# Altium schematic sheet 07_USB_Type-C_DFP_DP_ALT.SchDoc: USB-C Connectors
size A2; Organization: Greenfield Tech Solutions; Address1: Molendreef 33; Address2: Ossendrecht; Address3: 4641CS; Address4: The Netherlands; SheetNumber: 7; SheetTotal: 11
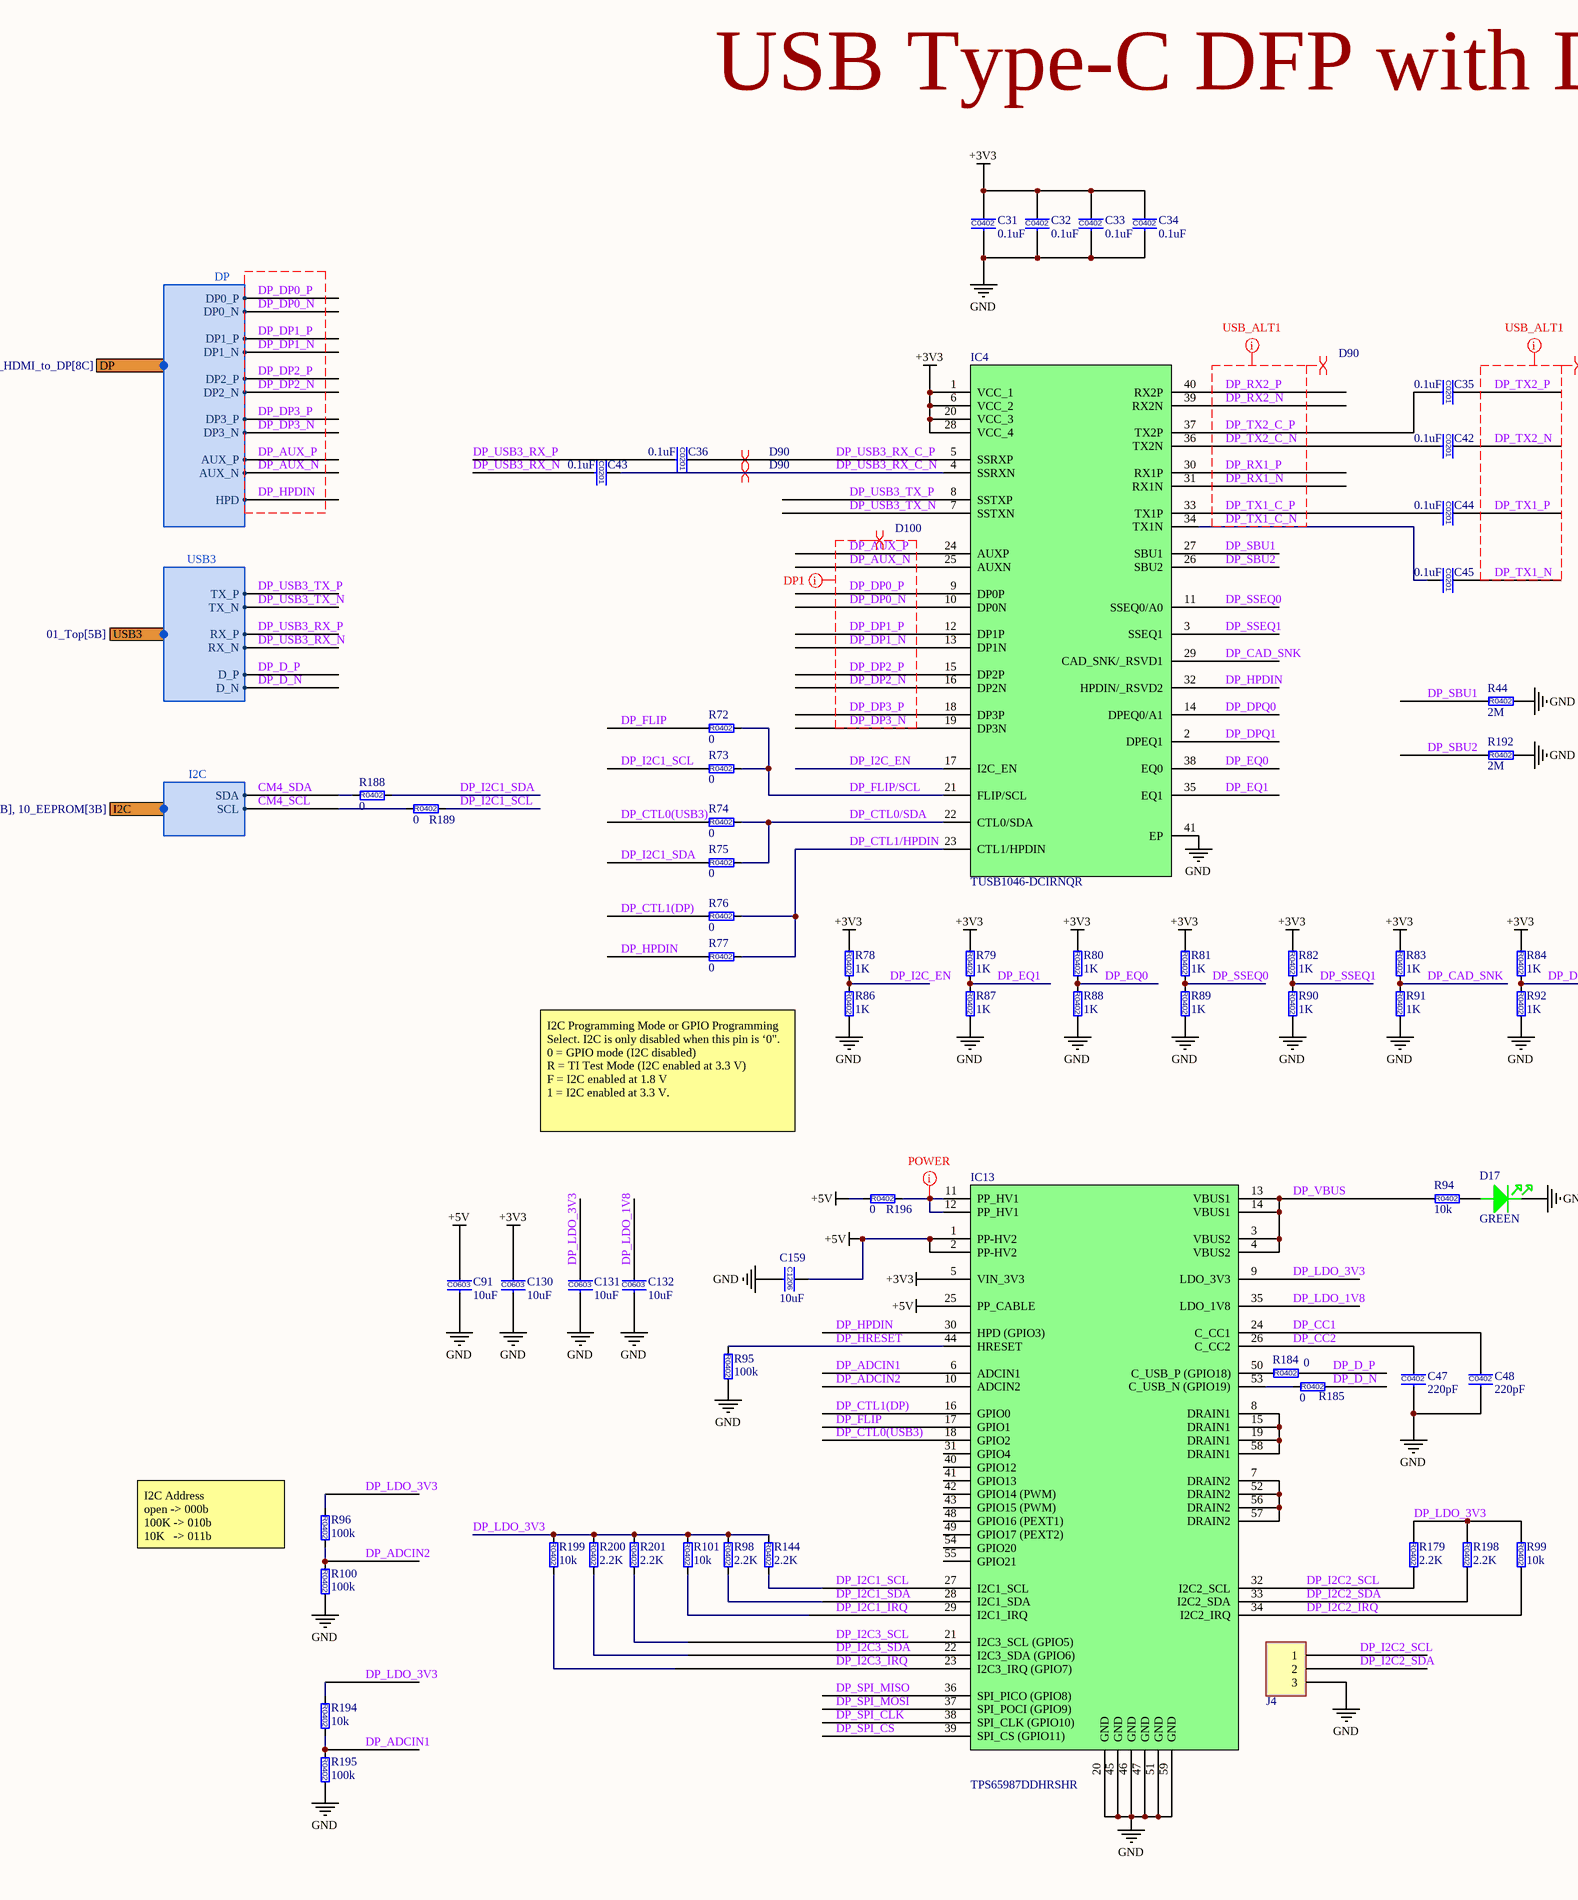
[diagram p0: 07_USB_Type-C_DFP_DP_ALT.SchDoc, left]
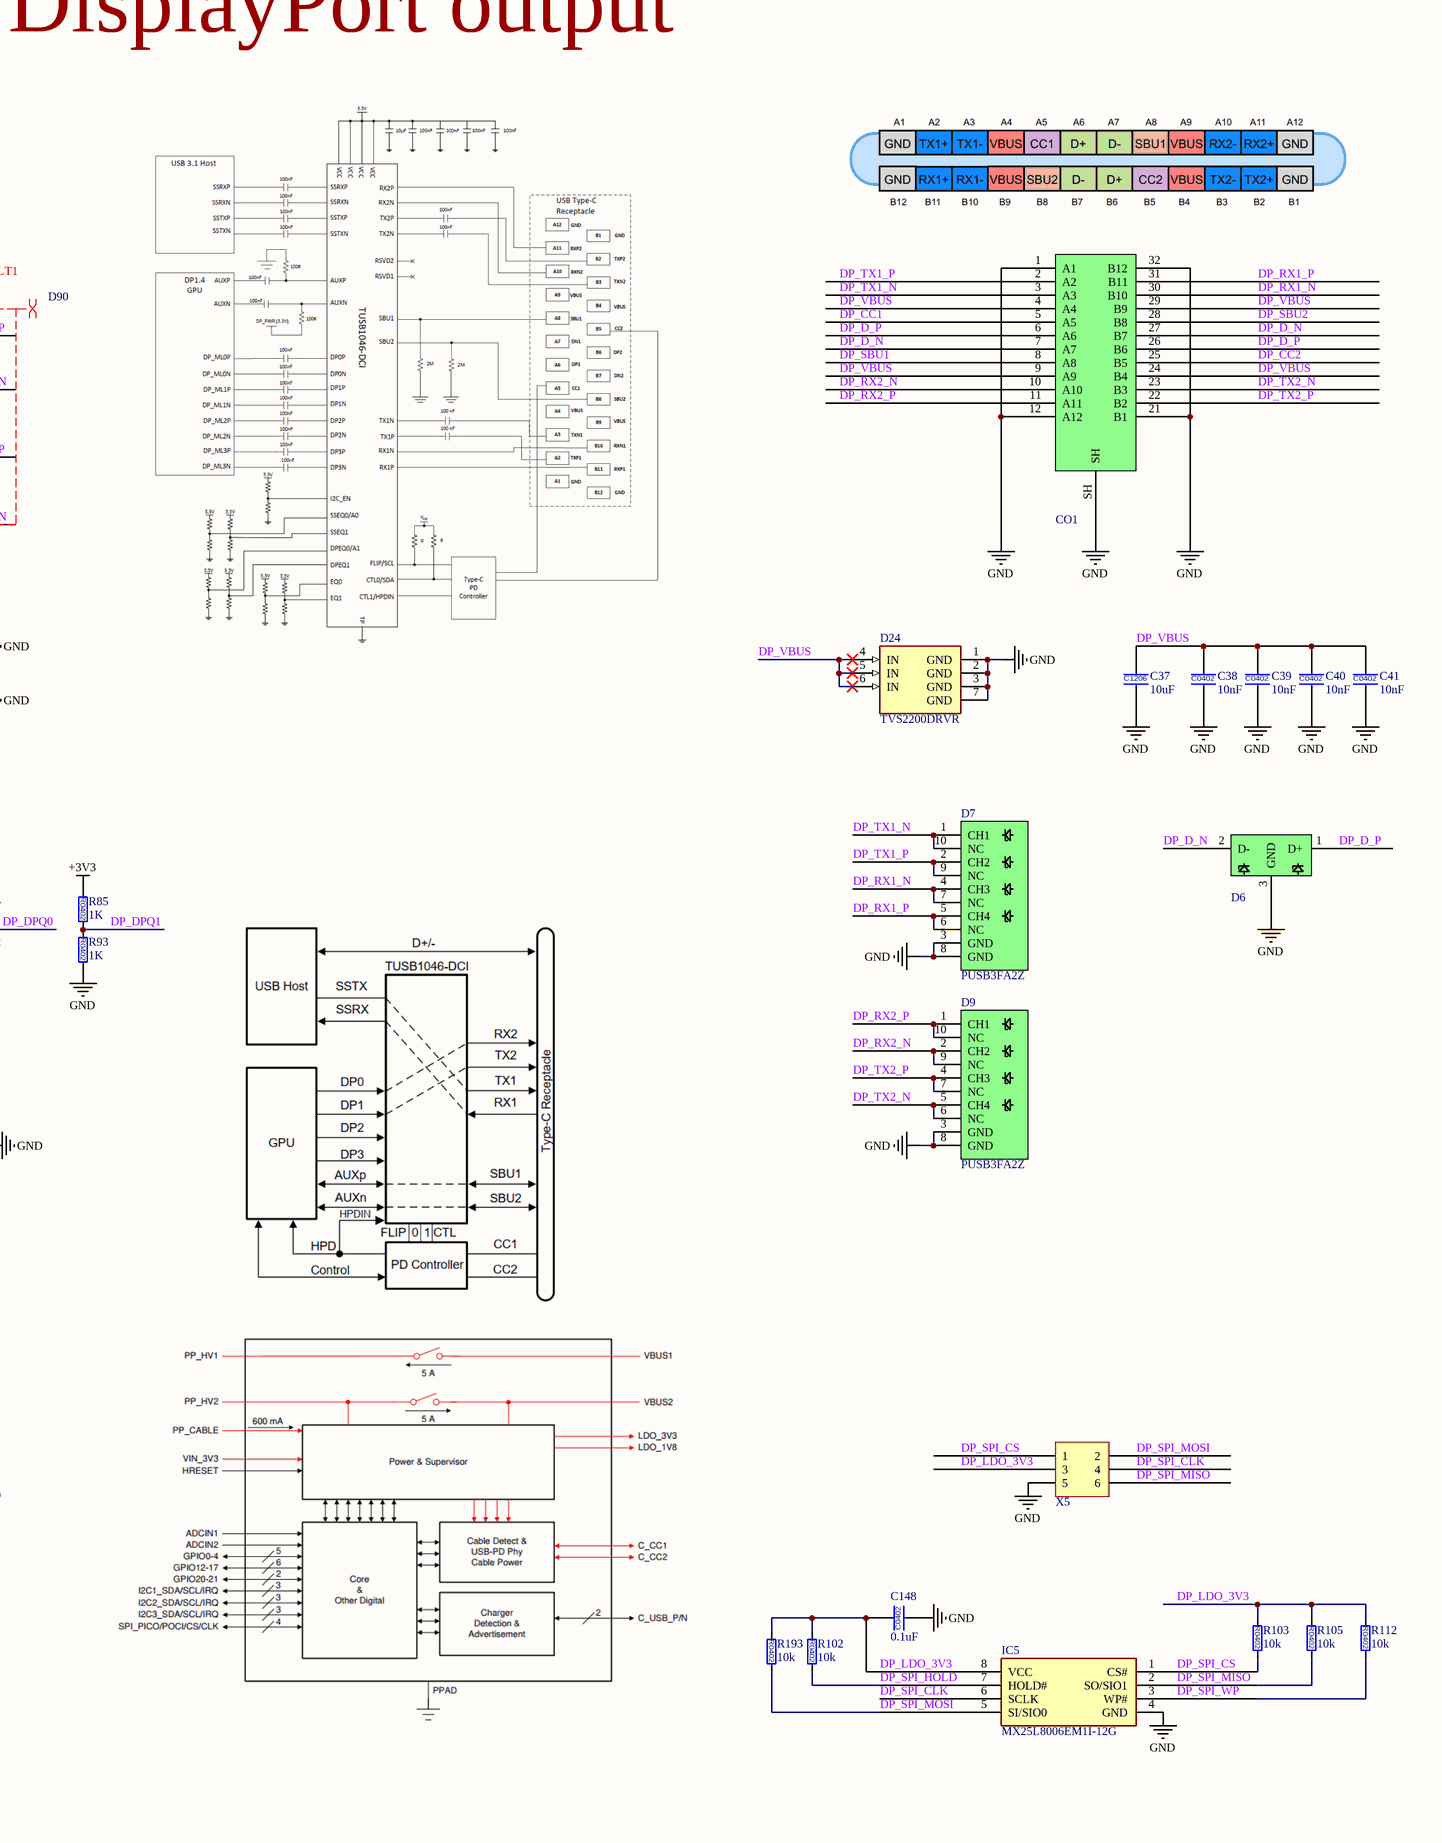
[diagram p1: 07_USB_Type-C_DFP_DP_ALT.SchDoc, right]

## Parts
C31  0.1uF  [C0402]
C32  0.1uF  [C0402]
C33  0.1uF  [C0402]
C34  0.1uF  [C0402]
C35  0.1uF  [C0201]
C36  0.1uF  [C0201]
C37  10uF  [C1206]
C38  10nF  [C0402]
C39  10nF  [C0402]
C40  10nF  [C0402]
C41  10nF  [C0402]
C42  0.1uF  [C0201]
C43  0.1uF  [C0201]
C44  0.1uF  [C0201]
C45  0.1uF  [C0201]
C47  220pF  [C0402]
C48  220pF  [C0402]
C91  10uF  [C0603]
C130  10uF  [C0603]
C131  10uF  [C0603]
C132  10uF  [C0603]
C148  0.1uF  [C0402]
C159  10uF  [C1206]
CO1  USB4070-30-C  [USB4070-30-C]  (value not drawn)
D6  TPD2EUSB30DRTR  [TPD2EUSB30DRTR_SOT-3]  (value not drawn)
D7  PUSB3FA2Z  [PUSB3FA2Z_DFN_2510_10]
D9  PUSB3FA2Z  [PUSB3FA2Z_DFN_2510_10]
D17  GREEN  [LED_0603]
D24  TVS2200DRVR  [TVS2200D_SON_6]
IC4  TUSB1046-DCIRNQR  [TUSB1046_WQFN_40]
IC5  MX25L8006EM1I-12G  [SOIC127P600X175-8N]
IC13  TPS65987DDHRSHR  [TPS65987D_VQFN-56]
J4  PLS-3  [PLS-3-3D]  (value not drawn)
R44  2M  [R0402]
R72  0  [R0402]
R73  0  [R0402]
R74  0  [R0402]
R75  0  [R0402]
R76  0  [R0402]
R77  0  [R0402]
R78  1K  [R0402]
R79  1K  [R0402]
R80  1K  [R0402]
R81  1K  [R0402]
R82  1K  [R0402]
R83  1K  [R0402]
R84  1K  [R0402]
R85  1K  [R0402]
R86  1K  [R0402]
R87  1K  [R0402]
R88  1K  [R0402]
R89  1K  [R0402]
R90  1K  [R0402]
R91  1K  [R0402]
R92  1K  [R0402]
R93  1K  [R0402]
R94  10k  [R0402]
R95  100k  [R0402]
R96  100k  [R0402]
R98  2.2K  [R0402]
R99  10k  [R0402]
R100  100k  [R0402]
R101  10k  [R0402]
R102  10k  [R0402]
R103  10k  [R0402]
R105  10k  [R0402]
R112  10k  [R0402]
R144  2.2K  [R0402]
R179  2.2K  [R0402]
R184  0  [R0402]
R185  0  [R0402]
R188  0  [R0402]
R189  0  [R0402]
R192  2M  [R0402]
R193  10k  [R0402]
R194  10k  [R0402]
R195  100k  [R0402]
R196  0  [R0402]
R198  2.2K  [R0402]
R199  10k  [R0402]
R200  2.2K  [R0402]
R201  2.2K  [R0402]
X5  PBD-6  [PXD-6]  (value not drawn)

## Ports
DP (harness DP, see 01_Top[4B], 05_HDMI_to_DP[8C]), I2C (harness I2C, see 01_Top[4B], 03_RPiCM4[1B], 05_HDMI_to_DP[1B], 06_USB_Type-C_DFP[1B], 08_USB_Type-C_DFP_DP_ALT_buttom[1B], 09_RTC[3B], 10_EEPROM[3B]), USB3 (harness USB3, see 01_Top[5B])

## Harnesses
USB3: TX_P, TX_N, RX_P, RX_N, D_P, D_N
I2C: SDA, SCL
DP: DP0_P, DP1_P, DP1_N, DP0_N, DP3_P, DP3_N, DP2_P, DP2_N, AUX_P, AUX_N, HPD

## Nets
+3V3: C31.1 C32.1 C33.1 C34.1 C130.1 IC4.1(VCC_1) IC4.6(VCC_2) IC4.20(VCC_3) IC4.28(VCC_4) IC13.5(VIN_3V3) R78.1 R79.1 R80.1 R81.1 R82.1 R83.1 R84.1 R85.1
+5V: C91.1 C159.1 IC13.1(PP-HV2) IC13.2(PP-HV2) IC13.25(PP_CABLE) R196.1
GND: C31.2 C32.2 C33.2 C34.2 C37.2 C38.2 C39.2 C40.2 C41.2 C47.2 C48.2 C91.2 C130.2 C131.2 C132.2 C148.2 C159.2 CO1.1(A1) CO1.12(A12) CO1.21(B1) CO1.32(B12) CO1.SH D6.3(GND) D7.3(GND) D7.8(GND) D9.3(GND) D9.8(GND) D17.1(Cathode) D24.1(GND) D24.2(GND) D24.3(GND) D24.7(GND) IC4.41(EP) IC5.4(GND) IC13.20(GND) IC13.45(GND) IC13.46(GND) IC13.47(GND) IC13.51(GND) IC13.59(GND) J4.3 R44.2 R86.2 R87.2 R88.2 R89.2 R90.2 R91.2 R92.2 R93.2 R95.2 R100.2 R192.2 R195.2 X5.5
CM4_SCL: R189.1 ; port I2C.SCL
CM4_SDA: R188.1 ; port I2C.SDA
DP_ADCIN1: IC13.6(ADCIN1) R194.2 R195.1
DP_ADCIN2: IC13.10(ADCIN2) R96.2 R100.1
DP_AUX_N: IC4.25(AUXN) ; port DP.AUX_N
DP_AUX_P: IC4.24(AUXP) ; port DP.AUX_P
DP_CAD_SNK: IC4.29(CAD_SNK/_RSVD1) R83.2 R91.1
DP_CC1: C48.1 CO1.5(A5) IC13.24(C_CC1)
DP_CC2: C47.1 CO1.25(B5) IC13.26(C_CC2)
DP_CTL0(USB3): IC13.18(GPIO2) R74.1
DP_CTL0/SDA: IC4.22(CTL0/SDA) R74.2 R75.2
DP_CTL1(DP): IC13.16(GPIO0) R76.1
DP_CTL1/HPDIN: IC4.23(CTL1/HPDIN) R76.2 R77.2
DP_D_N: CO1.7(A7) CO1.27(B7) D6.2(D-) R185.2 ; port USB3.D_N
DP_D_P: CO1.6(A6) CO1.26(B6) D6.1(D+) R184.2 ; port USB3.D_P
DP_DP0_N: IC4.10(DP0N) ; port DP.DP0_N
DP_DP0_P: IC4.9(DP0P) ; port DP.DP0_P
DP_DP1_N: IC4.13(DP1N) ; port DP.DP1_N
DP_DP1_P: IC4.12(DP1P) ; port DP.DP1_P
DP_DP2_N: IC4.16(DP2N) ; port DP.DP2_N
DP_DP2_P: IC4.15(DP2P) ; port DP.DP2_P
DP_DP3_N: IC4.19(DP3N) ; port DP.DP3_N
DP_DP3_P: IC4.18(DP3P) ; port DP.DP3_P
DP_DPQ0: IC4.14(DPEQ0/A1) R84.2 R92.1
DP_DPQ1: IC4.2(DPEQ1) R85.2 R93.1
DP_EQ0: IC4.38(EQ0) R80.2 R88.1
DP_EQ1: IC4.35(EQ1) R79.2 R87.1
DP_FLIP: IC13.17(GPIO1) R72.1
DP_FLIP/SCL: IC4.21(FLIP/SCL) R72.2 R73.2
DP_HPDIN: IC4.32(HPDIN/_RSVD2) IC13.30(HPD_(GPIO3)) R77.1 ; port DP.HPD
DP_HRESET: IC13.44(HRESET) R95.1
DP_I2C1_IRQ: IC13.29(I2C1_IRQ) R101.2
DP_I2C1_SCL: IC13.27(I2C1_SCL) R73.1 R144.2 R189.2
DP_I2C1_SDA: IC13.28(I2C1_SDA) R75.1 R98.2 R188.2
DP_I2C2_IRQ: IC13.34(I2C2_IRQ) R99.2
DP_I2C2_SCL: IC13.32(I2C2_SCL) J4.1 R179.2
DP_I2C2_SDA: IC13.33(I2C2_SDA) J4.2 R198.2
DP_I2C3_IRQ: IC13.23(I2C3_IRQ_(GPIO7)) R199.2
DP_I2C3_SCL: IC13.21(I2C3_SCL_(GPIO5)) R201.2
DP_I2C3_SDA: IC13.22(I2C3_SDA_(GPIO6)) R200.2
DP_I2C_EN: IC4.17(I2C_EN) R78.2 R86.1
DP_LDO_1V8: C132.1 IC13.35(LDO_1V8)
DP_LDO_3V3: C131.1 C148.1 IC5.8(VCC) IC13.9(LDO_3V3) R96.1 R98.1 R99.1 R101.1 R102.1 R103.1 R105.1 R112.1 R144.1 R179.1 R193.1 R194.1 R198.1 R199.1 R200.1 R201.1 X5.3
DP_RX1_N: CO1.30(B10) D7.4(CH3) D7.7(NC) IC4.31(RX1N)
DP_RX1_P: CO1.31(B11) D7.5(CH4) D7.6(NC) IC4.30(RX1P)
DP_RX2_N: CO1.10(A10) D9.2(CH2) D9.9(NC) IC4.39(RX2N)
DP_RX2_P: CO1.11(A11) D9.1(CH1) D9.10(NC) IC4.40(RX2P)
DP_SBU1: CO1.8(A8) IC4.27(SBU1) R44.1
DP_SBU2: CO1.28(B8) IC4.26(SBU2) R192.1
DP_SPI_CLK: IC5.6(SCLK) IC13.38(SPI_CLK_(GPIO10)) X5.4
DP_SPI_CS: IC5.1(CS#) IC13.39(SPI_CS_(GPIO11)) R103.2 X5.1
DP_SPI_HOLD: IC5.7(HOLD#) R102.2
DP_SPI_MISO: IC5.2(SO/SIO1) IC13.36(SPI_PICO_(GPIO8)) R105.2 X5.6
DP_SPI_MOSI: IC5.5(SI/SIO0) IC13.37(SPI_POCI_(GPIO9)) R193.2 X5.2
DP_SPI_WP: IC5.3(WP#) R112.2
DP_SSEQ0: IC4.11(SSEQ0/A0) R81.2 R89.1
DP_SSEQ1: IC4.3(SSEQ1) R82.2 R90.1
DP_TX1_C_N: C45.2 IC4.34(TX1N)
DP_TX1_C_P: C44.2 IC4.33(TX1P)
DP_TX1_N: C45.1 CO1.3(A3) D7.1(CH1) D7.10(NC)
DP_TX1_P: C44.1 CO1.2(A2) D7.2(CH2) D7.9(NC)
DP_TX2_C_N: C42.2 IC4.36(TX2N)
DP_TX2_C_P: C35.2 IC4.37(TX2P)
DP_TX2_N: C42.1 CO1.23(B3) D9.5(CH4) D9.6(NC)
DP_TX2_P: C35.1 CO1.22(B2) D9.4(CH3) D9.7(NC)
DP_USB3_RX_C_N: C43.1 IC4.4(SSRXN)
DP_USB3_RX_C_P: C36.1 IC4.5(SSRXP)
DP_USB3_RX_N: C43.2 ; port USB3.RX_N
DP_USB3_RX_P: C36.2 ; port USB3.RX_P
DP_USB3_TX_N: IC4.7(SSTXN) ; port USB3.TX_N
DP_USB3_TX_P: IC4.8(SSTXP) ; port USB3.TX_P
DP_VBUS: C37.1 C38.1 C39.1 C40.1 C41.1 CO1.4(A4) CO1.9(A9) CO1.24(B4) CO1.29(B9) D24.4(IN) D24.5(IN) D24.6(IN) IC13.3(VBUS2) IC13.4(VBUS2) IC13.13(VBUS1) IC13.14(VBUS1) R94.1
NetD17_2: D17.2(Anode) R94.2
NetIC13_7: IC13.7(DRAIN2) IC13.52(DRAIN2) IC13.56(DRAIN2) IC13.57(DRAIN2)
NetIC13_8: IC13.8(DRAIN1) IC13.15(DRAIN1) IC13.19(DRAIN1) IC13.58(DRAIN1)
NetIC13_11: IC13.11(PP_HV1) IC13.12(PP_HV1) R196.2
NetIC13_50: IC13.50(C_USB_P_(GPIO18)) R184.1
NetIC13_53: IC13.53(C_USB_N_(GPIO19)) R185.1

Not connected (* = marked no-connect by the designer): IC13 31(GPIO4) 40(GPIO12) 41(GPIO13) 42(GPIO14_(PWM)) 43(GPIO15_(PWM)) 48(GPIO16_(PEXT1)) 49(GPIO17_(PEXT2)) 54(GPIO20) 55(GPIO21)

## Layout directives
differential pair; differential pair class D100: DP_AUX_N, DP_AUX_P, DP_DP0_N, DP_DP0_P, DP_DP1_N, DP_DP1_P, DP_DP2_N, DP_DP2_P, DP_DP3_N, DP_DP3_P
net class DP1: DP_AUX_N, DP_AUX_P, DP_DP0_N, DP_DP0_P, DP_DP1_N, DP_DP1_P, DP_DP2_N, DP_DP2_P, DP_DP3_N, DP_DP3_P
differential pair; differential pair class D90: DP_RX1_N, DP_RX1_P, DP_RX2_N, DP_RX2_P, DP_TX1_C_N, DP_TX1_C_P, DP_TX1_N, DP_TX1_P, DP_TX2_C_N, DP_TX2_C_P, DP_TX2_N, DP_TX2_P, DP_USB3_RX_C_N, DP_USB3_RX_C_P
net class USB_ALT1: DP_RX1_N, DP_RX1_P, DP_RX2_N, DP_RX2_P, DP_TX1_C_N, DP_TX1_C_P, DP_TX1_N, DP_TX1_P, DP_TX2_C_N, DP_TX2_C_P, DP_TX2_N, DP_TX2_P
net class POWER: NetIC13_11

## Notes on the sheet
- USB Type-C DFP with DisplayPort output
- I2C Programming Mode or GPIO Programming Select. I2C is only disabled when this pin is ‘0".
  0 = GPIO mode (I2C disabled)
  R = TI Test Mode (I2C enabled at 3.3 V)
  F = I2C enabled at 1.8 V
  1 = I2C enabled at 3.3 V.
- I2C Address
  open -> 000b
  100K -> 010b
  10K   -> 011b
- Title
- Size:
- Date:
- File:
- A2
- Number:
- Time:
- Revision:
- Sheet
- of
- (in symbol 0603ZD106KAT2A) C0603
- (in symbol 02016D104KAT) C0201
- (in symbol 04023A221JAT4A) C0402
- (in symbol 04023D104KAT2A) C0402
- (in symbol 04025C103JAT2A) C0402
- (in symbol 12065D106KAT4A) C1206
- (in symbol CRCW04021K00FKEDC) R0402
- (in symbol CRCW04022K20FK) R0402
- (in symbol CRCW04022M00FKEDC) R0402
- (in symbol CRCW040210K0FK) R0402
- (in symbol CRCW0402100KFKEDC) R0402
- (in symbol CRCW04020000Z0) R0402

## Library data of the parts
C31-C34 C148 = 04023D104KAT2A: CAP CER  0.1uF 10% 25V X5R 0402; Manufacturer: AVX Corporation; Manufacturer Part Number: 04023D104KAT2A; Value: 0.1uF; Voltage - Rated: 25V; Tolerance: ±10%; Temperature Coefficient: X5R
C35 C36 C42-C45 = 02016D104KAT: CAP CER  0.1uF 10% 6.3V X5R 0201; Manufacturer: AVX Corporation; Capacitance: 100nF; Category: Capacitors; Manufacturer Part Number: 02016D104KAT; Operating Temperature: -55°C ~ 85°C; Package / Case: 0201; Value: 0.1uF; Voltage - Rated: 6.3V; Supplier: Digi-Key; Tolerance: ±10%; Temperature Coefficient: X5R; Mounting Type: Surface Mount, MLCC
C37 C159 = 12065D106KAT4A: CAP CER  10uF 10% 50V X5R 1206; Manufacturer: KYOCERA AVX; Value: 10µF; check: ok; Manufacturer Part Number: 12065D106KAT4A; Tolerance: ±10%; Voltage - Rated: 50V; Temperature Coefficient: X5R
C38-C41 = 04025C103JAT2A: CAP CER 10nF 5% 50V X7R 0402; Manufacturer: KYOCERA AVX; Manufacturer Part Number: 04025C103JAT2A; Operating Temperature: -55°C ~ 125°C; Package / Case: 0402 (1005 Metric); Value: 10nF; Voltage - Rated: 50V; Tolerance: ±5%; Temperature Coefficient: X7R
C47 C48 = 04023A221JAT4A: CAP CER  220pF 5% 25V NP0 0402; Manufacturer: KYOCERA AVX; Manufacturer Part Number: 04023A221JAT4A; Operating Temperature: -55°C ~ 125°C; Package / Case: 0402; Value: 220pF; Voltage - Rated: 25V; Tolerance: ±5%; Temperature Coefficient: NP0
C91 C130-C132 = 0603ZD106KAT2A: CAP CER 10uF 10% 10V X5R 0603; Manufacturer: KYOCERA AVX; Value: 10µF; Manufacturer Part Number: 0603ZD106KAT2A; Tolerance: ±10%; Voltage - Rated: 10V; Temperature Coefficient: X5R
CO1 = USB4070-30-C: 24 Position 20 VDC USB Type C Horizontal USB 3.1 Receptacle Connector; Part Number: CO0021; Manufacturer: Global Connector Technology; ID: 16; USB Standard: USB 3.1; Number of Contacts: 24; Number of Ports: 1; Mating Cycles: 10000; Shielding: Shielded; ManfactPart: USB4070-30-C; Supplier 1: Farnell; Manufacturer Part Number: USB4070-30-C; RoHS: No; Category: USB Connectors; Stock 1: 87; Pricing 1: 1=3.37000, 10=2.90000, 30=2.83000, 80=2.69000, 200=2.64000 (GBP); Mount: Surface Mount,Through Hole,Vertical; Contact Material: Copper Alloy; Contact Plating: Gold; Insulation Color: Black; Min Operating Temperature: -40°C; Max Operating Temperature: 85°C; Gender: Receptacle; Orientation: Vertical; Connector Type: USB; Series: USB4070; Packaging: Tape and Reel; Termination: Solder; Reach SVHC Compliant: Yes; Lead Free: Lead Free; Flammability Rating: UL94 V-0; ComponentLink1URL: http://www.farnell.com/datasheets/2342947.pdf?src-supplier=Farnell; ComponentLink1Description: http://www.farnell.com/datasheets/2342947.pdf?src-supplier=Farnell; ComponentLink2URL: http://www.farnell.com/cad/2113628.pdf?src-supplier=Element14; ComponentLink2Description: http://www.farnell.com/cad/2113628.pdf?src-supplier=Element14; ComponentLink3URL: http://www.farnell.com/datasheets/2342947.pdf?src-supplier=Newark; ComponentLink3Description: http://www.farnell.com/datasheets/2342947.pdf?src-supplier=Newark; RefVal: USB4070; Supplier Part Number 1: 2784985
D6 = TPD2EUSB30DRTR: Dual 0.7-pF, 5.5-V ±8-kV ESD protection diode with 5-A surge rating for USB 3.0 3-SOT-9X3 -40 to 85; Manufacturer: Texas Instruments; Direction: Bidirectional,Unidirectional; Capacitance: 0.8pF; Number of Bidirectional Channels: 2; Reverse Standoff Voltage: 5.5V; Min Breakdown Voltage: 9V; Clamping Voltage: 8V; Peak Pulse Power: 45W; Power Line Protection: Yes; Test Current: 1mA; Peak Pulse Current: 1A; Supplier 1: Mouser; Manufacturer Part Number: TPD2EUSB30DRTR; RoHS: Yes; Category: Integrated Circuits (ICs); Pricing 1: 1=0.66000, 10=0.56100, 50=0.56000, 100=0.41900, 1000=0.25500, 10000=0.23100 (USD); Case/Package: SOT; Number of Pins: 3; Min Operating Temperature: -40°C; Max Operating Temperature: 85°C; Packaging: Tape and Reel; Package Quantity: 1; Breakdown Voltage: 9V; Number of Channels: 2; Working Voltage: 5.5V; ESD Protection: Yes; Element Configuration: Dual; Interface: USB; Series: -; Number of Unidirectional Channels: 2; Length: 1mm; Width: 0.85mm; Height: 0.45mm; Depth: 0.8mm; Radiation Hardening: No; Reach SVHC Compliant: Yes; Lead Free: Lead Free; RoHS Compliant: Yes; ComponentLink1URL: https://datasheet.ciiva.com/1611/tpd2eusb30-1611602.pdf?src-supplier=Newark; ComponentLink1Description: https://datasheet.ciiva.com/1611/tpd2eusb30-1611602.pdf?src-supplier=Newark; ComponentLink2URL: https://datasheet.ciiva.com/15134/getdatasheetpartid-202713-15134479.pdf?src-supplier=Verical; ComponentLink2Description: https://datasheet.ciiva.com/15134/getdatasheetpartid-202713-15134479.pdf?src-supplier=Verical; ComponentLink3URL: https://datasheet.ciiva.com/1504/1882087-1504248.pdf?src-supplier=Element14; ComponentLink3Description: https://datasheet.ciiva.com/1504/1882087-1504248.pdf?src-supplier=Element14; ComponentLink4URL: https://datasheet.ciiva.com/353/tpd2eusb30-353273.pdf?src-supplier=Digi-Key; ComponentLink4Description: https://datasheet.ciiva.com/353/tpd2eusb30-353273.pdf?src-supplier=Digi-Key; ComponentLink5URL: https://datasheet.ciiva.com/353/tpd2eusb30-353272.pdf?src-supplier=Digi-Key; ComponentLink5Description: https://datasheet.ciiva.com/353/tpd2eusb30-353272.pdf?src-supplier=Digi-Key; ComponentLink6URL: https://datasheet.ciiva.com/353/tpd2eusb30-353274.pdf?src-supplier=Digi-Key; ComponentLink6Description: https://datasheet.ciiva.com/353/tpd2eusb30-353274.pdf?src-supplier=Digi-Key; Supplier Part Number 1: 595-TPD2EUSB30DRTR
D7 D9 = PUSB3FA2Z: PUSB3FA2/SOT1176/XSON10; Part Number: DI0007; Manufacturer: Nexperia; ID: 7; RefVal: TVS; ManfactPart: PUSB3FA2Z; Supplier 1: Digi-Key; Manufacturer Part Number: PUSB3FA2Z; RoHS: No; Category: TVS Diodes; Stock 1: 8565; Pricing 1: 1=0.39000, 10=0.31700, 100=0.21570, 500=0.16178, 1000=0.12134, 2000=0.11123 (USD); ComponentLink1URL: http://www.farnell.com/datasheets/2621625.pdf?src-supplier=Farnell; ComponentLink1Description: http://www.farnell.com/datasheets/2621625.pdf?src-supplier=Farnell; ComponentLink2URL: https://assets.nexperia.com/documents/data-sheet/PUSB3FA2.pdf?src-supplier=Digi-Key; ComponentLink2Description: https://assets.nexperia.com/documents/data-sheet/PUSB3FA2.pdf?src-supplier=Digi-Key; ComponentLink3URL: http://www.farnell.com/datasheets/2621625.pdf?src-supplier=Newark; ComponentLink3Description: http://www.farnell.com/datasheets/2621625.pdf?src-supplier=Newark; Supplier Part Number 1: 1727-7813-1-ND; Supplier 2: Farnell; Stock 2: 8440; Pricing 2: 5=0.31600, 10=0.25800, 100=0.17600, 500=0.13300, 1000=0.11400, 5000=0.09420 (GBP); Supplier 3: Digi-Key; Stock 3: 5000; Pricing 3: 5000=0.10449, 10000=0.09774, 25000=0.09450 (USD); Supplier Part Number 3: 1727-7813-2-ND; Supplier Part Number 2: 2901054
D17 = LED_SMD_0603_GREEN: LED Uni-Color Yellow Green 574nm 2-Pin Chip 0603(1608Metric) T/R; Manufacturer: Vishay Semiconductors; Manufacturer Part Number: VLMG1300-GS08; Color: Green,Yellow; Forward Voltage: 2V; Forward Current: 20mA; Lens Style: Rectangular,Clear; Luminous Intensity: 35mcd; Number of LEDs: 1; Viewing Angle: 130°; Dominant Wavelength: 571nm; Power Dissipation: 75mW; Reverse Voltage: 5V; Supplier 1: Farnell; RoHS: Yes; Category: LEDs; Stock 1: 18400; Pricing 1: 5=0.31000, 10=0.23700, 100=0.10900, 500=0.09900 (EUR); Mount: Surface Mount; Case/Package: 0603; Number of Pins: 2; Case Code (Metric): 1608; Case Code (Imperial): 0603; Min Operating Temperature: -35°C; Max Operating Temperature: 85°C; Packaging: Tape and Reel; Package Quantity: 1; Series: CHipLED; Illumination Color: Green,Yellow; Wavelength: 571nm; Test Current: 20mA; Number of Elements: 1; Power Rating: 75mW; Length: 1.6mm; Width: 0.8mm; Height: 0.8mm; Depth: 0.8mm; Radiation Hardening: No; RoHS Compliant: Yes; Lead Free: Lead Free; ComponentLink1URL: https://datasheet.ciiva.com/8028/vlmo1300-8028023.pdf?src-supplier=Element14; ComponentLink1Description: https://datasheet.ciiva.com/8028/vlmo1300-8028023.pdf?src-supplier=Element14; ComponentLink2URL: https://datasheet.ciiva.com/2114/vlmo1300-2114971.pdf?src-supplier=Digi-Key; ComponentLink2Description: https://datasheet.ciiva.com/2114/vlmo1300-2114971.pdf?src-supplier=Digi-Key; ComponentLink3URL: https://datasheet.ciiva.com/26322/vlmo1300-26322139.pdf?src-supplier=Element14; ComponentLink3Description: https://datasheet.ciiva.com/26322/vlmo1300-26322139.pdf?src-supplier=Element14; ComponentLink4URL: https://datasheet.ciiva.com/2114/vlmo1300-2114972.pdf?src-supplier=Digi-Key; ComponentLink4Description: https://datasheet.ciiva.com/2114/vlmo1300-2114972.pdf?src-supplier=Digi-Key; ComponentLink5URL: https://datasheet.ciiva.com/26322/vlmo1300-26322140.pdf?src-supplier=Element14; ComponentLink5Description: https://datasheet.ciiva.com/26322/vlmo1300-26322140.pdf?src-supplier=Element14; ComponentLink6URL: https://datasheet.ciiva.com/2114/vlmo1300-2114973.pdf?src-supplier=Digi-Key; ComponentLink6Description: https://datasheet.ciiva.com/2114/vlmo1300-2114973.pdf?src-supplier=Digi-Key; ComponentLink7URL: https://datasheet.ciiva.com/9333/vlmo1300-9333390.pdf?src-supplier=Avnet; ComponentLink7Description: https://datasheet.ciiva.com/9333/vlmo1300-9333390.pdf?src-supplier=Avnet; Supplier Part Number 1: 2251461
D24 = TVS2200DRVR: 22-V flat-clamp surge protection device 6-WSON -40 to 125; Manufacturer: Texas Instruments; Reverse Standoff Voltage: 22V; Standoff Height: 0mm; Clamping Voltage: 27.7V; Number Of Channels: 1; Capacitance: 105pF; Value: 105pF; Direction: Unidirectional; Breakdown Voltage: 24.6V; Peak Pulse Current: 40A; Package: DRV0006A; Category: Diode; Device Class L3: unset; Device Class L1: Circuit Protection; Temperature: -40°C to +125°C; ComponentLink2Description: Datasheet; Height: 0.8mm; Ambient Temperature Range Low: -40°C; Octopart: https://octopart.com/tvs2200drvr-texas+instruments-88217346; Temperature Range High: +125°C; Automotive: No; Temperature Range Low: -40°C; Ipc Land Pattern Name: DFN200X200X75-6; Manufacturer Part Number: TVS2200DRVR; Device Class L2: ESD and Circuit Protection ICs; RoHS: TRUE; Lead Free: Yes; Ambient Temperature Range High: +125°C; Mouser Description: Diode TVS Single Uni-Dir 22V 1.12KW 6-Pin WSON EP T/R; ComponentLink2URL: http://www.ti.com/lit/ds/symlink/tvs2200.pdf; Digikey Description: UNIDIR PRECISION SURGE DIODE; Supplier 1: Mouser; Pricing 1: 1=0.56000, 10=0.47800, 50=0.44600, 100=0.35700, 1000=0.21700, 10000=0.19700 (USD); Mount: Surface Mount; Min Operating Temperature: -40°C; Max Operating Temperature: 125°C; Packaging: Tape and Reel; Number of Circuits: 1; RoHS Compliant: Yes; ComponentLink1URL: http://www.ti.com/lit/ds/symlink/tvs2200.pdf?src-supplier=Digi-Key; ComponentLink1Description: http://www.ti.com/lit/ds/symlink/tvs2200.pdf?src-supplier=Digi-Key; ComponentLink3URL: http://www.ti.com/general/docs/suppproductinfo.tsp?distId=10&amp;gotoUrl=http%3A%2F%2Fwww.ti.com%2Flit%2Fgpn%2Ftvs2200&src-supplier=Digi-Key; ComponentLink3Description: http://www.ti.com/general/docs/suppproductinfo.tsp?distId=10&amp;gotoUrl=http%3A%2F%2Fwww.ti.com%2Flit%2Fgpn%2Ftvs2200&src-supplier=Digi-Key; Supplier Part Number 1: 595-TVS2200DRVR
IC4 = TUSB1046-DCIRNQR: USB Type-C™ DP ALT Mode 10-Gbps linear redriver crosspoint switch for source side 40-WQFN -40 to 85; Manufacturer: Texas Instruments; Manufacturer Part Number: TUSB1046AI-DCIRNQR; Number of Channels: 4; On-State Resistance: 10R; Datasheet Link: https://www.ti.com/lit/ds/symlink/tusb1046-dci.pdf?ts=1635509425736&ref_url=https%253A%252F%252Fwww.google.com%252F; Height: 0.8mm; Mouser Part Number: 595-TUSB1046-DCIRNQR; Mouser Price/Stock: https://www.mouser.co.uk/ProductDetail/Texas-Instruments/TUSB1046-DCIRNQR?qs=Euq2YPj5ArLS2CQihiHSYg%3D%3D; Arrow Part Number: TUSB1046-DCIRNQR; Arrow Price/Stock: https://www.arrow.com/en/products/tusb1046-dcirnqr/texas-instruments; Supplier 1: Mouser; RoHS: Yes; Category: Integrated Circuits (ICs); Pricing 1: 1=9.42000, 10=8.51000, 50=8.12000, 100=7.05000, 1000=5.75000, 10000=5.74000 (USD); Min Operating Temperature: -40°C; Max Operating Temperature: 85°C; RoHS Compliant: Yes; ComponentLink1URL: http://www.ti.com/lit/ds/symlink/tusb1046a-dci.pdf?src-supplier=Digi-Key; ComponentLink1Description: http://www.ti.com/lit/ds/symlink/tusb1046a-dci.pdf?src-supplier=Digi-Key; Supplier Part Number 1: 595-USB1046AIDCIRNQR
IC5 = MX25L8006EM1I-12G: NOR Flash Serial 3.3V 8M-bit 8M/4M x 1/2-bit 8ns 8-Pin SOP / IC FLASH 8MBIT 86MHZ 8SOP; Manufacturer_Name: Macronix; Operating Supply Voltage: 3.6V; Density: 8Mb; Interface: SPI,Serial; Memory Type: FLASH,NOR; Datasheet Link: https://www.mxic.com.tw/Lists/Datasheet/Attachments/7445/MX25L8006E,%203V,%208Mb,%20v1.6.pdf; Height: 1.75mm; Manufacturer_Part_Number: MX25L8006EM1I-12G; Arrow Part Number: MX25L8006EM1I-12G; Arrow Price/Stock: https://www.arrow.com/en/products/mx25l8006em1i-12g/macronix-international?region=nac; Supplier 1: Digi-Key; Manufacturer: Macronix; Manufacturer Part Number: MX25L8006EM1I-12G; RoHS: Yes; Category: Flash; Stock 1: 66203; Pricing 1: 1=0.58000, 10=0.52500, 25=0.51880, 50=0.51580, 100=0.46120, 250=0.45736, 500=0.45058, 1000=0.43446, 5000=0.39572 (USD); Case/Package: SOIC; Min Operating Temperature: -40°C; Max Operating Temperature: 85°C; Max Frequency: 86MHz; Package Quantity: 98; Packaging: Rail/Tube; Frequency: 86MHz; Series: MX25xxx05/06; Supply Voltage-Nom: 3.6V; Lead Free: Lead Free; Temperature Grade: INDUSTRIAL; RoHS Compliant: Yes; ComponentLink1URL: http://ckassoc.com/oldsite/pdf/Macronix_Product_Line_Card_July_2017_General%20_070617.pdf?src-supplier=Digi-Key; ComponentLink1Description: http://ckassoc.com/oldsite/pdf/Macronix_Product_Line_Card_July_2017_General%20_070617.pdf?src-supplier=Digi-Key; ComponentLink2URL: http://www.macronix.com/QuickPlace/hq/PageLibrary4825740B00298A3B.nsf/h_Index/3F21BAC2E121E17848257639003A3146/$File/MX25L8006E,%203V,%208Mb,%20v1.3.pdf?src-supplier=Future+Electronics; ComponentLink2Description: http://www.macronix.com/QuickPlace/hq/PageLibrary4825740B00298A3B.nsf/h_Index/3F21BAC2E121E17848257639003A3146/$File/MX25L8006E,%203V,%208Mb,%20v1.3.pdf?src-supplier=Future+Electronics; Supplier Part Number 1: 1092-1117-ND
IC13 = TPS65987DDHRSHR: USB Type-C™ and USB PD controller with integrated power switches 56-VQFN -10 to 75; Part Number: IC0052; Manufacturer: Texas Instruments; ID: 52; Operating Supply Current: 8mA; ManfactPart: TPS65987DDHRSHR; Supplier 1: Digi-Key; Manufacturer Part Number: TPS65987DDHRSHR; RoHS: Yes; Category: Power Management ICs; Stock 1: 6720; Pricing 1: 1=4.92000, 10=4.41700, 25=4.17600, 100=3.61930, 250=3.43372, 500=3.08106, 1000=2.62650 (USD); Mount: Surface Mount; Case/Package: VQFN; Min Operating Temperature: -10°C; Max Operating Temperature: 75°C; Packaging: Tape and Reel; RoHS Compliant: Yes; ComponentLink1URL: http://www.ti.com/lit/ds/symlink/tps65987d.pdf?src-supplier=Digi-Key; ComponentLink1Description: http://www.ti.com/lit/ds/symlink/tps65987d.pdf?src-supplier=Digi-Key; ComponentLink2URL: http://www.ti.com/general/docs/suppproductinfo.tsp?distId=10&amp;gotoUrl=http%3A%2F%2Fwww.ti.com%2Flit%2Fgpn%2Ftps65987d&src-supplier=Digi-Key; ComponentLink2Description: http://www.ti.com/general/docs/suppproductinfo.tsp?distId=10&amp;gotoUrl=http%3A%2F%2Fwww.ti.com%2Flit%2Fgpn%2Ftps65987d&src-supplier=Digi-Key; RefVal: TPS65987D; Supplier Part Number 1: 296-52067-1-ND
J4 = PLS-3: Board to Board Connector Straight Header Single Row 3 Position 2.54mm Pitch Through Hole Bag; Manufacturer: Amphenol; Manufacturer Part Number: G800W305018EU; Supplier 1: Mouser; RoHS: Yes; Category: Connectors; Stock 1: 26660; Pricing 1: 1=0.10000, 10=0.04200, 50=0.04200, 100=0.04000, 1000=0.03500, 10000=0.03000 (USD); Supplier Part Number 1: 523-G800W305018EU
R44 R192 = CRCW04022M00FKEDC: RES SMD 2M ohm 1% 1/16W R0402; Manufacturer: Vishay; check: ok; Manufacturer Part Number: CRCW04022M00FKEDC; Value: 2M; Power (Watts): 1/16W; Package / Case: 0402; Tolerance: ±1%
R72-R77 R184 R185 R188 R189 R196 = CRCW04020000Z0: RES SMD 0 ohm 1/16W R0402; Manufacturer: Vishay Dale; Manufacturer Part Number: CRCW04020000Z0; Value: 0; Power (Watts): 1/16W; Package / Case: 0402
R78-R93 = CRCW04021K00FKEDC: RES SMD 1K ohm 1% 1/16W R0402; Manufacturer: Vishay; check: ok; Manufacturer Part Number: CRCW04021K00FKEDC; Value: 1K; Power (Watts): 1/16W; Package / Case: 0402; Tolerance: ±1%
R94 R99 R101 R194 R199 = CRCW040210K0FK: RES SMD 10K ohm 1% 1/16W R0402; Manufacturer: Vishay; check: ok; Manufacturer Part Number: CRCW040210K0FK; Value: 10K; Power (Watts): 1/16W; Package / Case: 0402; Tolerance: ±1%
R95 R96 R100 R195 = CRCW0402100KFKEDC: RES SMD 100K ohm 1% 1/16W R0402; Manufacturer: Vishay; check: ok; Manufacturer Part Number: CRCW0402100KFKEDC; Value: 100K; Power (Watts): 1/16W; Package / Case: 0402; Tolerance: ±1%
R98 R144 R179 R198 R200 R201 = CRCW04022K20FK: RES SMD 2.2K ohm 1% 1/16W R0402; Manufacturer: Vishay; check: ok; Manufacturer Part Number: CRCW04022K20FK; Value: 2.2K; Power (Watts): 1/16W; Package / Case: 0402; Tolerance: ±1%
R102 R103 R105 R112 R193 = CRCW040210K0FK: RES SMD 10K ohm 1% 1/16W R0402; Manufacturer: Vishay Dale; Manufacturer Part Number: CRCW040210K0FK; Value: 10K; Power (Watts): 1/16W; Package / Case: 0402; Tolerance: ±1%
X5 = PBD-6: Conn Unshrouded Header HDR 6 POS 2.54mm Solder ST Thru-Hole Poly Bag; Manufacturer: Amphenol ICC / FCI; Manufacturer Part Number: 10076801-101-06LF; LatestRevisionDate: 17-Jul-2002; LatestRevisionNote: Re-released for DXP Platform.; Publisher: Altium Limited; Supplier 1: Mouser; RoHS: Yes; Category: Headers and Wire Housings; Stock 1: 1821; Pricing 1: 1=0.75000, 10=0.63400, 50=0.63400, 100=0.56500, 1000=0.41000, 10000=0.34100 (USD); ComponentLink1URL: https://datasheet.ciiva.com/9472/10076801-9472106.pdf?src-supplier=Avnet; ComponentLink1Description: https://datasheet.ciiva.com/9472/10076801-9472106.pdf?src-supplier=Avnet; Supplier Part Number 1: 649-1007680110106LF